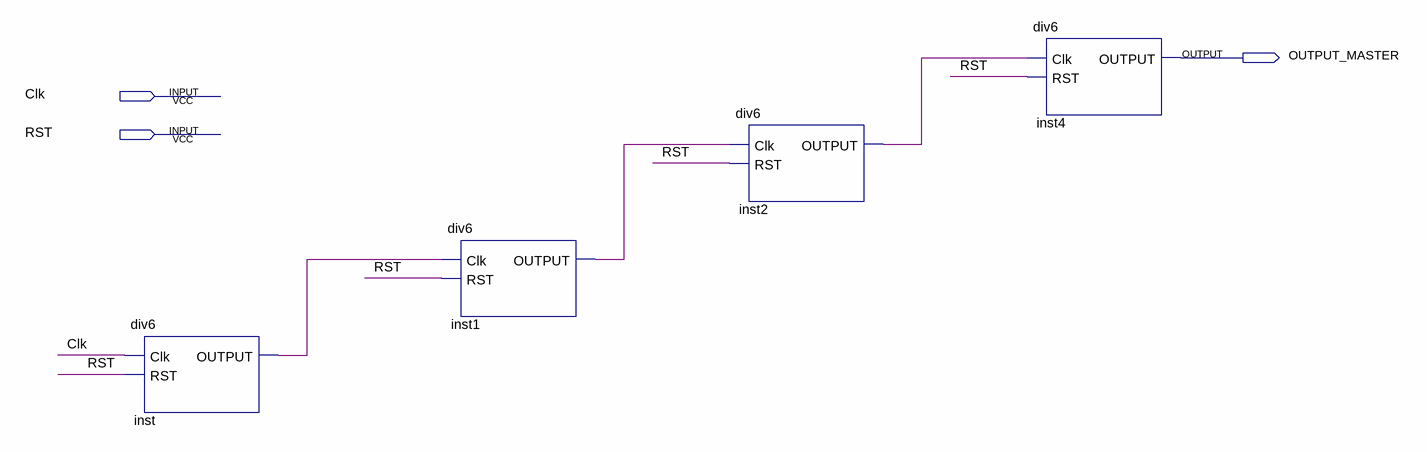
[diagram p0: schematic sheet]
// Quartus schematic divisorFreq.bdf as structural Verilog: 4 symbols, 3 pins
module divisorFreq (
  input  Clk,
  input  RST,
  output OUTPUT_MASTER
);

  wire inst1_output, inst2_output, inst_output;

  div6 inst (.Clk(Clk), .RST(RST), .OUTPUT(inst_output));
  div6 inst1 (.Clk(inst_output), .RST(RST), .OUTPUT(inst1_output));
  div6 inst2 (.Clk(inst1_output), .RST(RST), .OUTPUT(inst2_output));
  div6 inst4 (.Clk(inst2_output), .RST(RST), .OUTPUT(OUTPUT_MASTER));
endmodule
